# Altium schematic sheet LPCXpresso55SXX.SchDoc
size A3; CheckedBy: José Ogando; Engineer: Eduardo Teofilo; Revision: A2; SheetNumber: 1; SheetTotal: 8
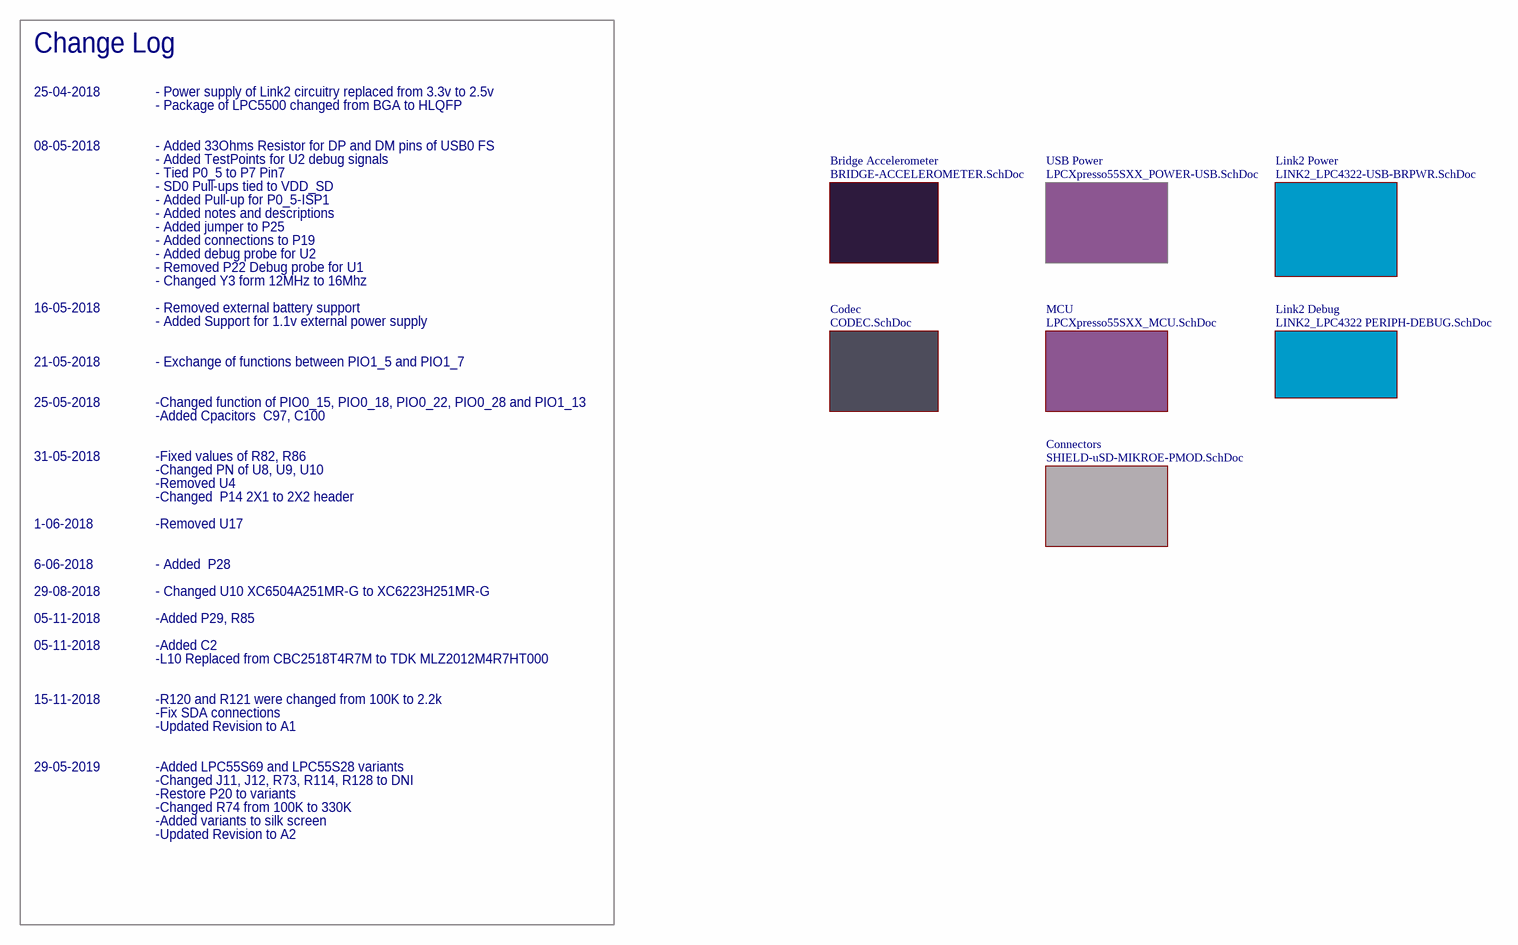
[diagram p0: LPCXpresso55SXX.SchDoc]

## Sub-sheets
Bridge Accelerometer = BRIDGE-ACCELEROMETER.SchDoc: no entries
Codec = CODEC.SchDoc: no entries
Connectors = SHIELD-uSD-MIKROE-PMOD.SchDoc: no entries
Link2 Debug = LINK2_LPC4322 PERIPH-DEBUG.SchDoc: no entries
Link2 Power = LINK2_LPC4322-USB-BRPWR.SchDoc: no entries
MCU = LPCXpresso55SXX_MCU.SchDoc: no entries
USB Power = LPCXpresso55SXX_POWER-USB.SchDoc: no entries

## Notes on the sheet
- Change Log
- 25-04-2018
- - Power supply of Link2 circuitry replaced from 3.3v to 2.5v
- - Package of LPC5500 changed from BGA to HLQFP
- 08-05-2018
- - Added 33Ohms Resistor for DP and DM pins of USB0 FS
- - Added TestPoints for U2 debug signals
- - Tied P0_5 to P7 Pin7
- - SD0 Pull-ups tied to VDD_SD
- - Added Pull-up for P0_5-ISP1
- - Added notes and descriptions
- - Added jumper to P25
- - Added connections to P19
- - Added debug probe for U2
- - Removed P22 Debug probe for U1
- 16-05-2018
- - Changed Y3 form 12MHz to 16Mhz
- - Removed external battery support
- - Added Support for 1.1v external power supply
- 21-05-2018
- 25-05-2018
- - Exchange of functions between PIO1_5 and PIO1_7
- -Changed function of PIO0_15, PIO0_18, PIO0_22, PIO0_28 and PIO1_13
- 31-05-2018
- -Added Cpacitors  C97, C100
- -Fixed values of R82, R86
- -Changed PN of U8, U9, U10
- 1-06-2018
- -Removed U4
- -Changed  P14 2X1 to 2X2 header
- -Removed U17
- 6-06-2018
- 29-08-2018
- - Added  P28
- - Changed U10 XC6504A251MR-G to XC6223H251MR-G
- 05-11-2018
- -Added P29, R85
- -Added C2
- -L10 Replaced from CBC2518T4R7M to TDK MLZ2012M4R7HT000
- 15-11-2018
- -R120 and R121 were changed from 100K to 2.2k
- -Fix SDA connections
- -Updated Revision to A1
- 29-05-2019
- -Changed J11, J12, R73, R114, R128 to DNI
- -Restore P20 to variants
- -Changed R74 from 100K to 330K
- -Added LPC55S69 and LPC55S28 variants
- -Updated Revision to A2
- -Added variants to silk screen
- Elaborated by:
- Checked by:
- Revision:
- Last revision date: